# EAGLE schematic BEP33_12panel stencil (EAGLE 7.7.0), part 4 of 4
## Sheet 13 of 14
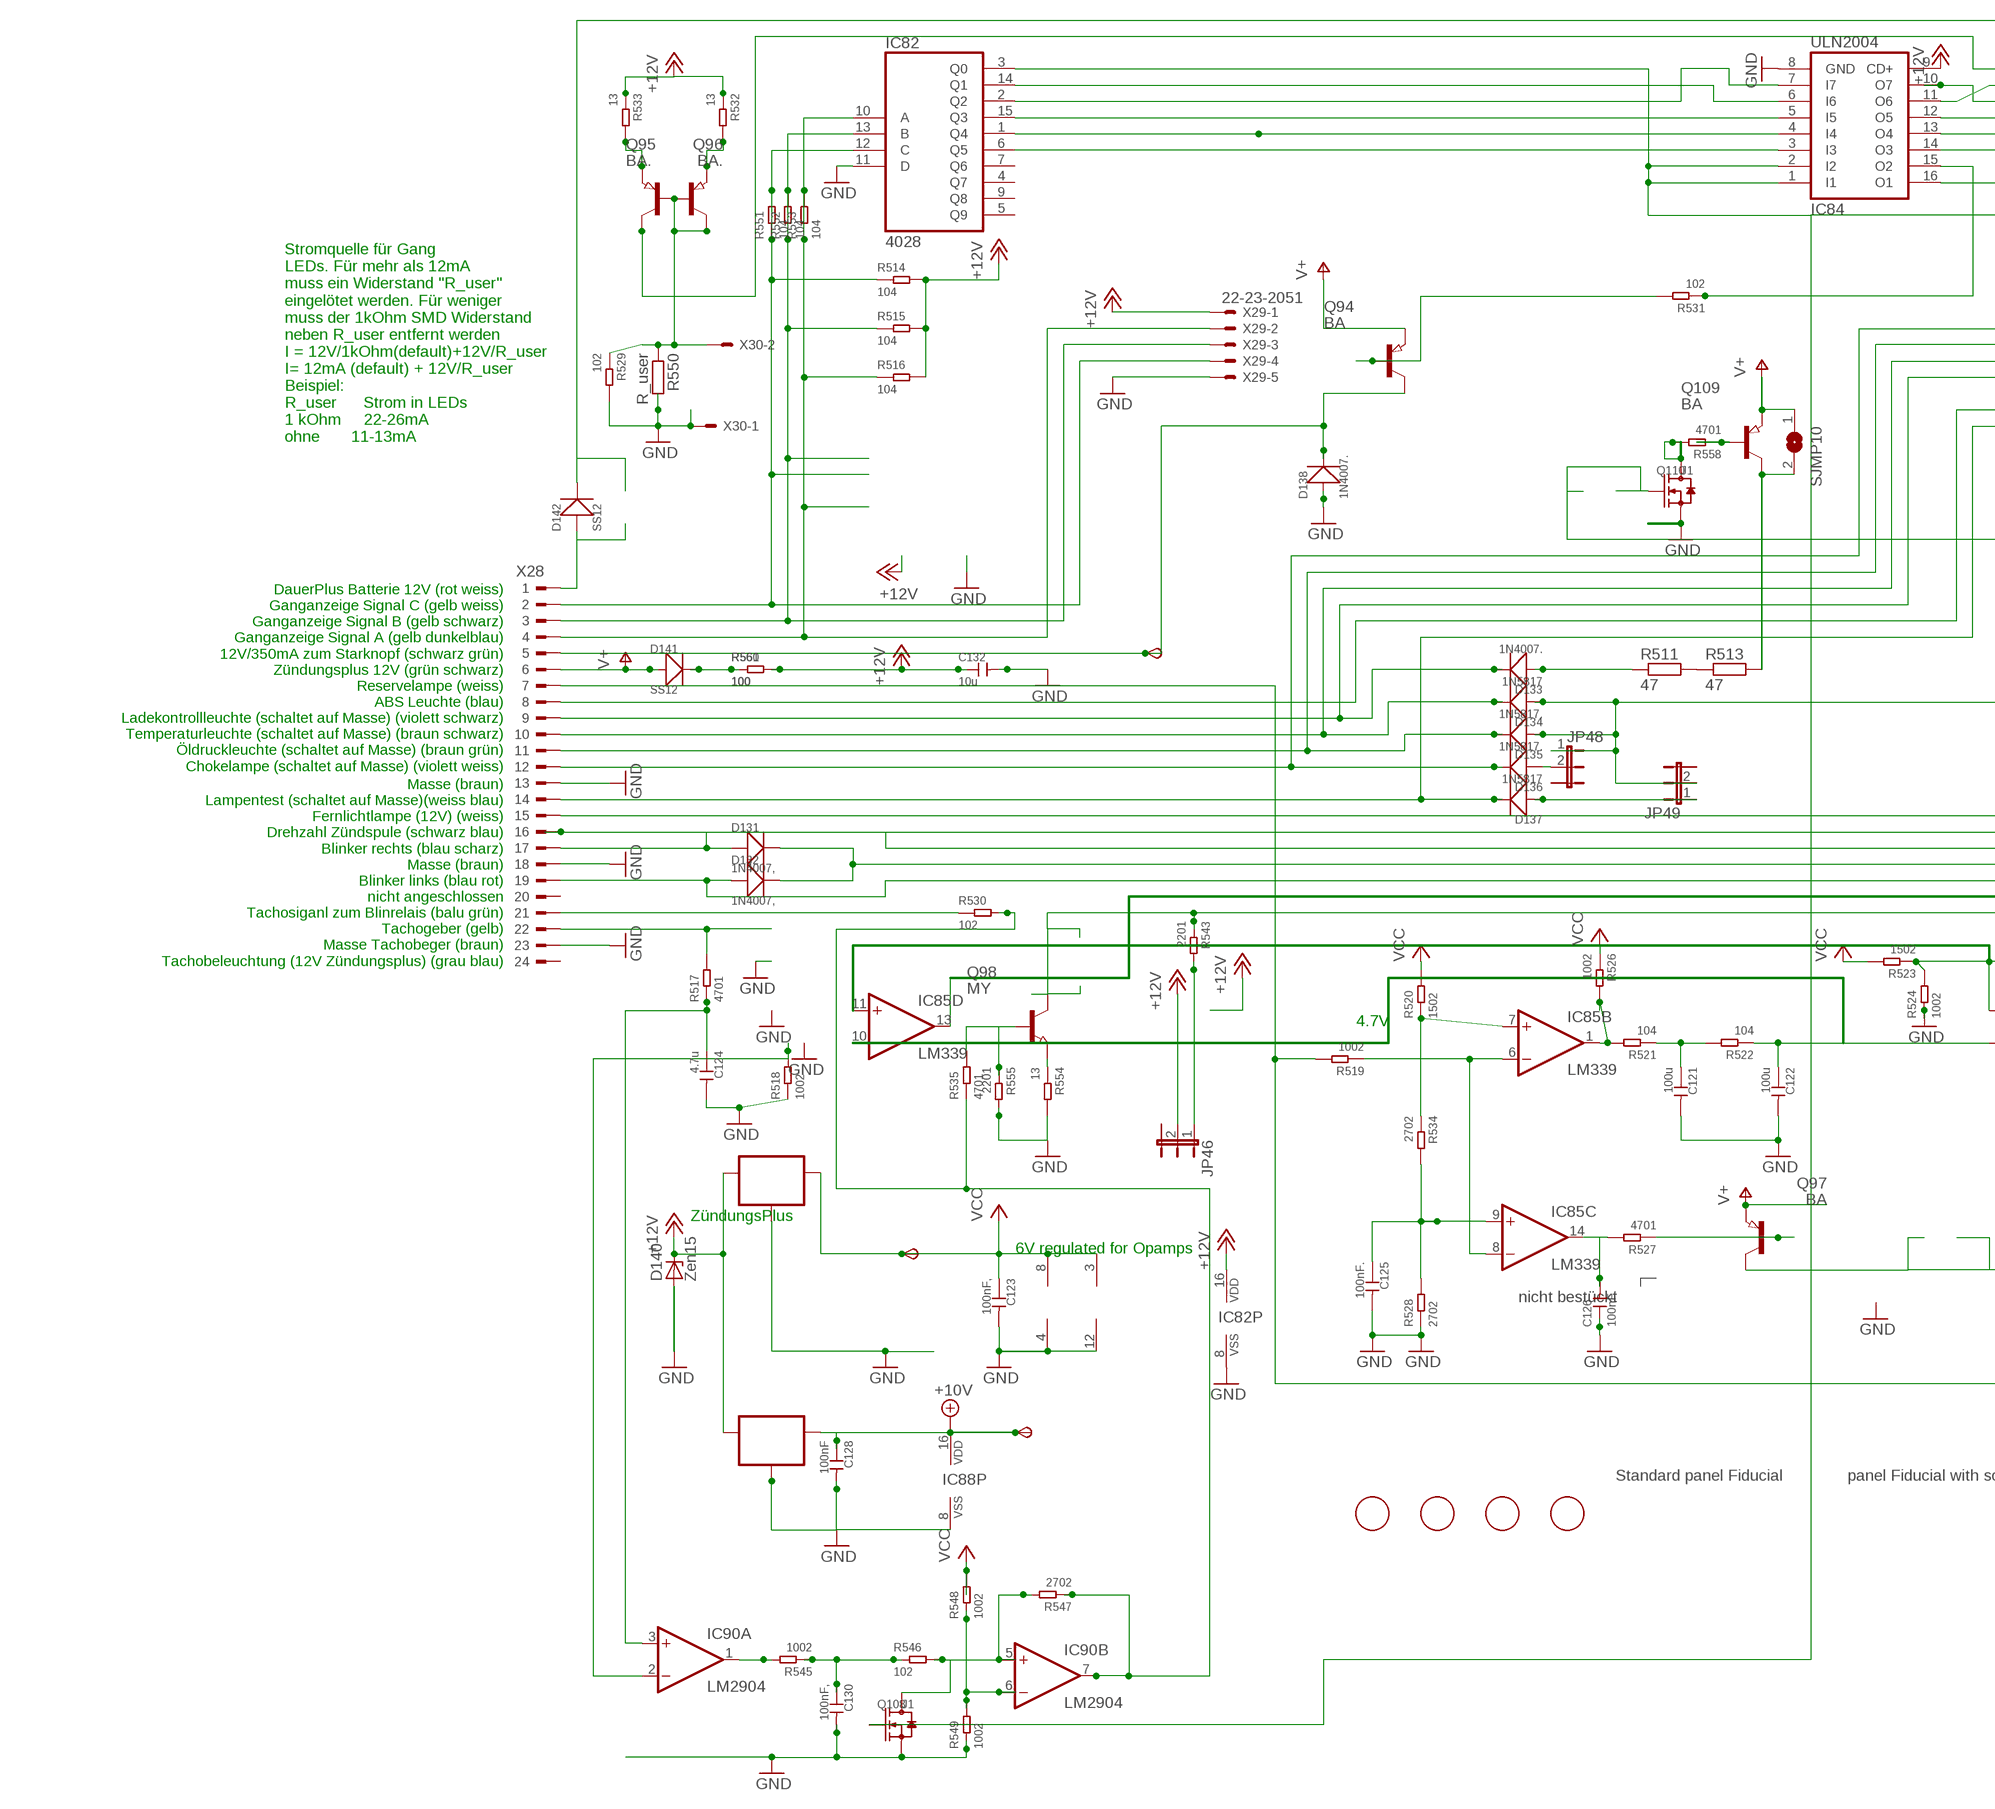
[diagram p22: schematic, sheet 13, part 1 of 2]
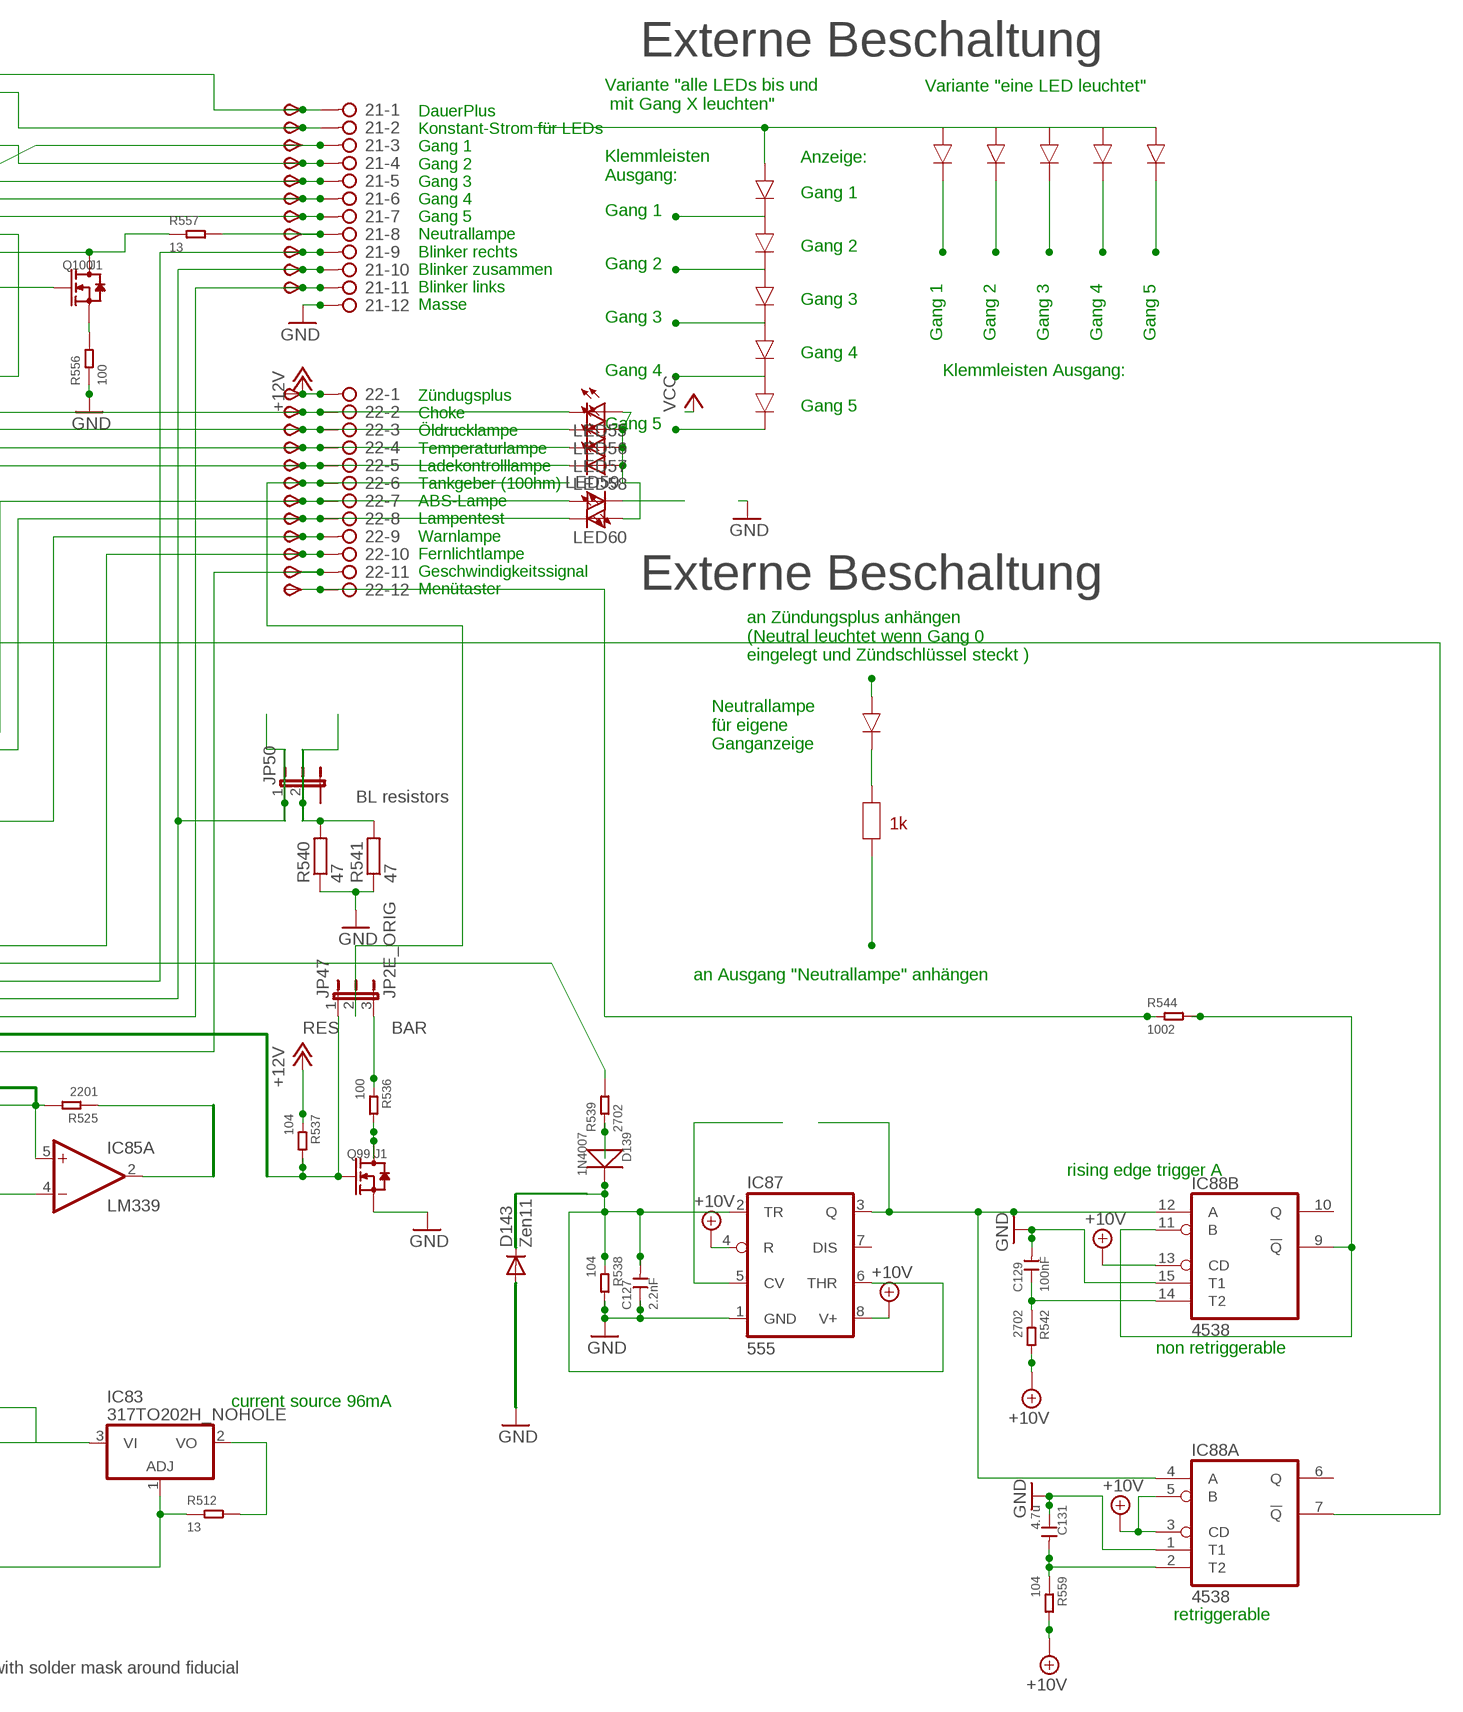
[diagram p23: schematic, sheet 13, part 2 of 2]

### Parts
6V10  TPSB2.0  [B2.0]
10V10  TPSB2.0  [B2.0]
21  2081-1132  [12-PIN]
22  2081-1132  [12-PIN]
C121  100u  CERAMIC-100UF-6.3V-20%-X5R(1206)  [C1206]
C122  100u  CERAMIC-100UF-6.3V-20%-X5R(1206)  [C1206]
C123  100nF,  CERAMIC-100NF-50V-10%-X7R(0805)  [C0805]
C124  4.7u  CERAMIC-4.7UF-25V-10%-X5R(0805)  [C0805]
C125  100nF.  CERAMIC-100NF-50V-10%-X7R(0805)  [C0805]
C126  100nF.  CERAMIC-100NF-50V-10%-X7R(0805)  [C0805]
C127  2.2nF  CERAMIC-100NF-50V-10%-X7R(0805)  [C0805]
C128  100nF  CERAMIC-100NF-50V-10%-X7R(0805)  [C0805]
C129  100nF  CERAMIC-100NF-50V-10%-X7R(0805)  [C0805]
C130  100nF,  CERAMIC-100NF-50V-10%-X7R(0805)  [C0805]
C131  4.7u  CERAMIC-4.7UF-25V-10%-X5R(0805)  [C0805]
C132  10u  CERAMIC-100UF-6.3V-20%-X5R(1206)  [C1206]
D131  1N4007,  DIODE-GEN-PURPOSE-1KV-1A(DO-214AC)  [DO-214AC]
D132  1N4007,  DIODE-GEN-PURPOSE-1KV-1A(DO-214AC)  [DO-214AC]
D133  1N4007.  DIODE-GEN-PURPOSE-1KV-1A(DO-214AC)  [DO-214AC]
D134  1N5817  DIODE-GEN-PURPOSE-1KV-1A(DO-214AC)DO-214AC/1206  [DO-214AC_SLIM]
D135  1N5817.  DIODE-GEN-PURPOSE-1KV-1A(DO-214AC)DO-214AC/1206  [DO-214AC_SLIM]
D136  1N5817.  DIODE-GEN-PURPOSE-1KV-1A(DO-214AC)DO-214AC/1206  [DO-214AC_SLIM]
D137  1N5817  DIODE-GEN-PURPOSE-1KV-1A(DO-214AC)DO-214AC/1206  [DO-214AC_SLIM]
D138  1N4007.  DIODE-GEN-PURPOSE-1KV-1A(DO-214AC)  [DO-214AC]
D139  1N4007  DIODE-GEN-PURPOSE-1KV-1A(DO-214AC)  [DO-214AC]
D140  Zen15  SM6T  [DO214AA]
D141  SS12  DIODE-GEN-PURPOSE-1KV-1A(DO-214AC)DO-214AC/1206  [DO-214AC_SLIM]
D142  SS12  DIODE-GEN-PURPOSE-1KV-1A(DO-214AC)DO-214AC/1206  [DO-214AC_SLIM]
D143  Zen11  CGRM4001-G  [SOD-123_MINI-SMA]
FID41  FIDUCIAL  [FIDUCIAL_1MM]
FID42  FIDUCIAL  [FIDUCIAL_1MM]
FID43  FIDUCIAL  [FIDUCIAL_1MM]
FID44  FIDUCIAL  [FIDUCIAL_1MM]
IC82  4028  4028D  [SO16]
IC83  317TO202H_NOHOLE  [TO220H_NOHOLE]
IC84  ULN2004  ULN2004AD  [SO16]
IC85  LM339  LM339D  [SO14]
IC86  78L06  78LXXSOT89_ROUND  [SOT89_ROUND]
IC87  555  NE555D  [SO08]
IC88  4538  4538D  [SO16]
IC89  78L10  78LXXSOT89_ROUND  [SOT89_ROUND]
IC90  LM2904  LM358D  [SO08]
JP46  JP2EJP2_SMALLPADS  [JP2_SMALLPADS]
JP47  JP2E_ORIG  [JP2_ORIG_SMALLPADS]
JP48  JP2EJP2_SMALLPADS  [JP2_SMALLPADS]
JP49  JP2EJP2_SMALLPADS  [JP2_SMALLPADS]
JP50  JP2EJP2_SMALLPADS  [JP2_SMALLPADS]
LED55  LEDLD260  [LD260]
LED56  LEDLD260  [LD260]
LED57  LEDLD260  [LD260]
LED58  LEDLD260  [LD260]
LED59  LEDLD260  [LD260]
LED60  LEDLD260  [LD260]
Q94  BA  PNP-TRANSISTOR_SOT89  [SOT89]
Q95  BA.  PNP-TRANSISTOR_SOT89  [SOT89]
Q96  BA.  PNP-TRANSISTOR_SOT89  [SOT89]
Q97  BA  PNP-TRANSISTOR_SOT89  [SOT89]
Q98  MY  NPN-TRANSISTOR_SOT89  [SOT89]
Q99  J1  SMD-MOSFET-N-CH-50V-200MA-BSS138W-7-F(SOT-23)  [SOT-23]
Q100  J1  SMD-MOSFET-N-CH-50V-200MA-BSS138W-7-F(SOT-23)  [SOT-23]
Q108  J1  SMD-MOSFET-N-CH-50V-200MA-BSS138W-7-F(SOT-23)  [SOT-23]
Q109  BA  PNP-TRANSISTOR_SOT89  [SOT89]
Q110  J1  SMD-MOSFET-N-CH-50V-200MA-BSS138W-7-F(SOT-23)  [SOT-23]
R511  47  R-EU_V235/17_1MM  [V235/17_1MM]
R512  13  SMD-RES-13R-5%-1/4W(1206)  [R1206]
R513  47  R-EU_V235/17_1MM  [V235/17_1MM]
R514  104  SMD-RES-10K-1%-1/8W(0805)  [R0805]
R515  104  SMD-RES-10K-1%-1/8W(0805)  [R0805]
R516  104  SMD-RES-10K-1%-1/8W(0805)  [R0805]
R517  4701  SMD-RES-4.7K-5%-1/8W(0805)  [R0805]
R518  1002  SMD-RES-10K-1%-1/8W(0805)  [R0805]
R519  1002  SMD-RES-10K-1%-1/8W(0805)  [R0805]
R520  1502  SMD-RES-10K-1%-1/8W(0805)  [R0805]
R521  104  SMD-RES-10K-1%-1/8W(0805)  [R0805]
R522  104  SMD-RES-10K-1%-1/8W(0805)  [R0805]
R523  1502  SMD-RES-10K-1%-1/8W(0805)  [R0805]
R524  1002  SMD-RES-10K-1%-1/8W(0805)  [R0805]
R525  2201  SMD-RES-2.2K-5%-1/8W(0805)  [R0805]
R526  1002  SMD-RES-10K-1%-1/8W(0805)  [R0805]
R527  4701  SMD-RES-4.7K-5%-1/8W(0805)  [R0805]
R528  2702  SMD-RES-4.7K-5%-1/8W(0805)  [R0805]
R529  102  SMD-RES-1K-5%-1/8W(0805)  [R0805]
R530  102  SMD-RES-220R-5%-1/8W(0805)  [R0805]
R531  102  SMD-RES-1K-5%-1/8W(0805)  [R0805]
R532  13  SMD-RES-13R-5%-1/4W(1206)  [R1206]
R533  13  SMD-RES-13R-5%-1/4W(1206)  [R1206]
R534  2702  SMD-RES-4.7K-5%-1/8W(0805)  [R0805]
R535  4701  SMD-RES-4.7K-5%-1/8W(0805)  [R0805]
R536  100  SMD-RES-2.2K-5%-1/8W(0805)  [R0805]
R537  104  SMD-RES-10K-1%-1/8W(0805)  [R0805]
R538  104  SMD-RES-10K-1%-1/8W(0805)  [R0805]
R539  2702  SMD-RES-10K-1%-1/8W(0805)  [R0805]
R540  47  R-EU_V235/17_1MM  [V235/17_1MM]
R541  47  R-EU_V235/17_1MM  [V235/17_1MM]
R542  2702  SMD-RES-4.7K-5%-1/8W(0805)  [R0805]
R543  2201  SMD-RES-2.2K-5%-1/8W(0805)  [R0805]
R544  1002  SMD-RES-4.7K-5%-1/8W(0805)  [R0805]
R545  1002  SMD-RES-10K-1%-1/8W(0805)  [R0805]
R546  102  SMD-RES-1K-5%-1/8W(0805)  [R0805]
R547  2702  SMD-RES-4.7K-5%-1/8W(0805)  [R0805]
R548  1002  SMD-RES-1K-5%-1/8W(0805)  [R0805]
R549  1002  SMD-RES-1K-5%-1/8W(0805)  [R0805]
R550  R_user  R-EU_R0805  [R0805]
R551  104  SMD-RES-10K-1%-1/8W(0805)  [R0805]
R552  104  SMD-RES-10K-1%-1/8W(0805)  [R0805]
R553  104  SMD-RES-10K-1%-1/8W(0805)  [R0805]
R554  13  SMD-RES-13R-5%-1/4W(1206)  [R1206]
R555  2201  SMD-RES-1K-5%-1/8W(0805)  [R0805]
R556  100  SMD-RES-220R-5%-1/8W(0805)  [R0805]
R557  13  SMD-RES-13R-5%-1/4W(1206)  [R1206]
R558  4701  SMD-RES-4.7K-5%-1/8W(0805)  [R0805]
R559  104  SMD-RES-4.7K-5%-1/8W(0805)  [R0805]
R560  100  SMD-RES-2.2K-5%-1/8W(0805)  [R0805]
R561  100  SMD-RES-2.2K-5%-1/8W(0805)  [R0805]
SJMP10  SJ  [SJ]
START10  TPSB2.0  [B2.0]
TP231  TPSB2.0  [B2.0]
TP232  TPSB2.0  [B2.0]
TP233  TPSB2.0  [B2.0]
TP234  TPSB2.0  [B2.0]
TP235  TPSB2.0  [B2.0]
TP236  TPSB2.0  [B2.0]
TP237  TPSB2.0  [B2.0]
TP238  TPSB2.0  [B2.0]
TP239  TPSB2.0  [B2.0]
TP240  TPSB2.0  [B2.0]
TP241  TPSB2.0  [B2.0]
TP242  TPSB2.0  [B2.0]
TP243  TPSB2.0  [B2.0]
TP244  TPSB2.0  [B2.0]
TP245  TPSB2.0  [B2.0]
TP246  TPSB2.0  [B2.0]
TP247  TPSB2.0  [B2.0]
TP248  TPSB2.0  [B2.0]
TP249  TPSB1,27  [B1,27]
TP250  TPSB2.0  [B2.0]
TP251  TPSB2.0  [B2.0]
TP252  TPSB2.0  [B2.0]
TP253  TPSB2.0  [B2.0]
X28  CON_BMWV2  [24-PIN_V2]
X29  22-23-2051  [22-23-2051]
X30  22-23-2021  [22-23-2021]

### Nets
+10V: 10V10.TP(PP) C128.1 IC87.4(R) IC87.8(V+) IC88.3(A:CD) IC88.5(A:B) IC88.13(B:CD) IC88.16(P:VDD) IC89.1(OUT) R542.2 R559.2 ; also sheet 2,3,4,5,6,7,9,10,11,12,14
+12V: 22.1 C132.1 D140.C IC82.16(VDD) IC84.9(CD+) IC86.3(IN) IC89.3(IN) JP46.2 R514.2 R515.2 R516.2 R532.1 R533.1 R537.1 R560.2 R561.2 TP252.TP(PP) X29.1 ; also sheet 2,3,4,5,6,7,9,10,11,12,14
+12V11: 22.11 Q98.2(C) R543.1 TP251.TP(PP)
GND: 21.12 C121.2 C122.2 C123.2 C124.2 C125.2 C126.1 C127.1 C128.2 C129.2 C130.2 C131.1 C132.2 D138.1(+) D140.A D143.A IC82.8(VSS) IC82.11(D) IC84.8(GND) IC85.12(P:GND) IC86.2(GND) IC86.2@1(GND) IC87.1(GND) IC88.1(A:T1) IC88.8(P:VSS) IC88.15(B:T1) IC89.2(GND) IC89.2@1(GND) IC90.4(P:V-) Q99.2(S) Q108.2(S) Q110.2(S) R518.1 R524.1 R528.1 R529.2 R538.2 R540.1 R541.1 R549.1 R550.2 R554.2 R555.2 R556.1 X28.13 X28.18 X28.23 X29.5 X30.1 ; also sheet 2,3,4,5,6,7,9,10,11,12,14
N$1800: R511.2 R513.1
N$1801: 22.9 D134.1(+) D135.1(+) JP48.1 JP49.2 TP249.TP(PP)
N$1802: IC82.10(A) R516.1 R553.1 R553.2 X28.4 X29.2
N$1803: IC82.13(B) R515.1 R552.1 R552.2 X28.3 X29.3
N$1804: D138.2(-) Q94.2(C) START10.TP(PP) X28.5
N$1805: IC82.12(C) R514.1 R551.1 R551.2 X28.2 X29.4
N$1806: 22.7 LED59.A TP247.TP(PP) X28.8
N$1807: 22.2 D136.2(-) LED55.K(C) TP242.TP(PP) X28.12
N$1808: 22.3 D135.2(-) LED56.K(C) TP243.TP(PP) X28.11
N$1809: 22.4 D134.2(-) LED57.K(C) TP244.TP(PP) X28.10
N$1810: 22.8 D137.2(-) LED60.K(C) TP248.TP(PP) X28.14
N$1811: 21.9 D131.1(+) TP239.TP(PP) X28.17
N$1812: 21.11 D132.1(+) TP241.TP(PP) X28.19
N$1813: R517.2 X28.22
N$1814: C124.1 IC90.3(A:+IN) R517.1
N$1815: IC85.1(B:OUT) R521.2 R526.2
N$1816: C121.1 R521.1 R522.2
N$1817: C122.1 IC85.4(A:-IN) IC85.10(D:-IN) R522.1
N$1818: IC85.5(A:+IN) IC85.11(D:+IN) R523.1 R524.2 R525.2
N$1819: C125.1 IC85.9(C:+IN) R528.2 R534.2
N$1820: C126.2 IC85.14(C:OUT) R527.2
N$1821: Q97.1(B) R527.1
N$1822: IC82.2(Q2) IC84.7(I7)
N$1823: 21.5 IC84.12(O5) TP235.TP(PP)
N$1824: IC82.1(Q4) IC84.4(I4)
N$1825: 22.10 TP250.TP(PP) X28.15
N$1826: 22.5 D133.2(-) LED58.K(C) TP245.TP(PP) X28.9
N$1827: D133.1(+) R511.1
N$1828: IC82.6(Q5) IC84.3(I3)
N$1829: 21.4 IC84.10(O7) TP234.TP(PP)
N$1830: IC83.1(ADJ) R512.1 R519.2 X28.7
N$1831: IC85.6(B:-IN) IC85.8(C:-IN) R519.1
N$1832: 21.2 Q96.2(C) TP232.TP(PP)
N$1833: 21.1 D142.2(-) TP231.TP(PP)
N$1847: R539.2 X28.16
N$1848: IC82.15(Q3) IC84.5(I5)
N$1849: 21.6 IC84.13(O4) TP236.TP(PP)
N$1850: 21.7 IC84.14(O3) TP237.TP(PP)
N$1851: 22.6 JP47.2 TP246.TP(PP)
N$1852: LED59.K(C)
N$1853: LED55.A LED56.A LED57.A LED58.A LED60.A
N$1854: Q94.1(B) R531.2
N$1855: IC82.3(Q0) IC84.1(I1) IC84.2(I2) Q100.1(G) Q108.1(G)
N$1856: IC82.14(Q1) IC84.6(I6)
N$1857: 21.3 IC84.11(O6) TP233.TP(PP)
N$1858: Q95.1(B) Q95.2(C) Q96.1(B) R529.1 R550.1 X30.2
N$1859: Q96.3(E) R533.2
N$1860: Q95.3(E) R532.2
N$1861: IC85.7(B:+IN) R520.1 R534.1
N$1862: IC90.2(A:-IN) R518.2
N$1863: Q98.1(B) R535.2 R555.1
N$1864: Q99.3(D) R536.2
N$1865: IC83.2(VO) R512.2
N$1866: IC83.3(VI) Q97.2(C)
N$1867: IC87.5(CV)
N$1868: IC87.3(Q) IC88.4(A:A) IC88.12(B:A)
N$1869: D139.1(+) R539.1
N$1870: 21.10 D131.2(-) D132.2(-) JP50.1 TP240.TP(PP)
N$1871: JP50.2 R540.2 R541.2
N$1872: IC88.9(B:!Q) IC88.11(B:B) R544.2
N$1873: C129.1 IC88.14(B:T2) R542.1
N$1874: JP46.1 R543.2
N$1875: IC84.15(O2) R531.1
N$1876: 22.12 R544.1 TP253.TP(PP)
N$1877: D136.1(+) JP48.2
N$1878: IC90.1(A:OUT) R545.2
N$1879: C130.1 R545.1 R546.1
N$1880: IC90.5(B:+IN) Q108.3(D) R546.2 R547.2
N$1881: IC90.6(B:-IN) R548.1 R549.2
N$1882: D137.1(+) JP49.1
N$1883: JP47.3 R536.1
N$1884: IC85.13(D:OUT) JP47.1 Q99.1(G) R537.2
N$1885: R530.1 X28.21
N$1886: IC84.16(O1) Q100.3(D) R557.1
N$1887: D141.2(-) R560.1 R561.1
N$1888: 21.8 R557.2 TP238.TP(PP)
N$1889: Q100.2(S) R556.2
N$1890: D142.1(+) X28.1
N$1891: Q98.3(E) R554.1
N$1892: C127.2 D139.2(-) D143.C IC87.2(TR) IC87.6(THR) R538.1
N$1893: Q109.1(B) R558.1
N$1894: Q110.3(D) R558.2
N$1895: Q109.2(C) R513.2 SJMP10.2
N$1896: IC90.7(B:OUT) R530.2 R535.1 R547.1
N$1897: IC85.2(A:OUT) R525.1
N$1898: IC88.7(A:!Q) Q110.1(G)
N$1899: C131.2 IC88.2(A:T2) R559.1
V+: D141.1(+) Q94.3(E) Q97.3(E) Q109.3(E) SJMP10.1 X28.6 ; also sheet 2,3,4,5,6,7,9,10,11,12,14
VCC: 6V10.TP(PP) C123.1 IC85.3(P:V+) IC86.1(OUT) IC90.8(P:V+) R520.2 R523.2 R526.1 R548.2 ; also sheet 2,3,4,5,6,7,9,10,11,12,14
Unconnected: IC82.4(Q7) IC82.5(Q9) IC82.7(Q6) IC82.9(Q8) IC87.7(DIS) IC88.6(A:Q) IC88.10(B:Q) X28.20 X28.24

### Notes on the sheet
- Externe Beschaltung
- Variante "eine LED leuchtet"
- Variante "alle LEDs bis und
   mit Gang X leuchten"
- Anzeige:
- Klemmleisten
  Ausgang:
- Gang 1
- DauerPlus
  Konstant-Strom für LEDs
  Gang 1
  Gang 2
  Gang 3
  Gang 4
  Gang 5
  Neutrallampe
  Blinker rechts
  Blinker zusammen
  Blinker links
  Masse
- Gang 1
- Gang 2
- Gang 2
- Gang 3
- Gang 3
- Gang 1 | Gang 2 | Gang 3 | Gang 4 | Gang 5
- Gang 4
- Gang 4 | Klemmleisten Ausgang:
- Gang 5
- Gang 5
- Zündugsplus
  Choke
  Öldrucklampe
  Temperaturlampe
  Ladekontrolllampe
  Tankgeber (100hm)
  ABS-Lampe
  Lampentest
  Warnlampe
  Fernlichtlampe
  Geschwindigkeitssignal
  Menütaster
- Stromquelle für Gang
  LEDs. Für mehr als 12mA
  muss ein Widerstand "R_user"
  eingelötet werden. Für weniger
  muss der 1kOhm SMD Widerstand
  neben R_user entfernt werden
  I = 12V/1kOhm(default)+12V/R_user
  I= 12mA (default) + 12V/R_user
  Beispiel:
  R_user      Strom in LEDs
  1 kOhm     22-26mA
  ohne       11-13mA
- Externe Beschaltung
- an Zündungsplus anhängen
  (Neutral leuchtet wenn Gang 0
  eingelegt und Zündschlüssel steckt )
- Neutrallampe
  für eigene
  Ganganzeige
- DauerPlus Batterie 12V (rot weiss)
  Ganganzeige Signal C (gelb weiss)
  Ganganzeige Signal B (gelb schwarz)
  Ganganzeige Signal A (gelb dunkelblau)
  12V/350mA zum Starknopf (schwarz grün)
  Zündungsplus 12V (grün schwarz)
  Reservelampe (weiss)
  ABS Leuchte (blau)
  Ladekontrollleuchte (schaltet auf Masse) (violett schwarz)
  Temperaturleuchte (schaltet auf Masse) (braun schwarz)
  Öldruckleuchte (schaltet auf Masse) (braun grün)
  Chokelampe (schaltet auf Masse) (violett weiss)
- BL resistors
- 1k
- an Ausgang "Neutrallampe" anhängen
- Masse (braun)
  Lampentest (schaltet auf Masse)(weiss blau)
  Fernlichtlampe (12V) (weiss)
  Drehzahl Zündspule (schwarz blau)
  Blinker rechts (blau scharz)
  Masse (braun)
  Blinker links (blau rot)
  nicht angeschlossen
  Tachosiganl zum Blinrelais (balu grün)
  Tachogeber (gelb)
  Masse Tachobeger (braun)
  Tachobeleuchtung (12V Zündungsplus) (grau blau)
- RES | BAR
- 4.7V | rising edge trigger A
- non retriggerable
- ZündungsPlus
- current source 96mA
- 6V regulated for Opamps
- nicht bestückt
- retriggerable
- Standard panel Fiducial | panel Fiducial with solder mask around fiducial

## Sheet 14 of 14
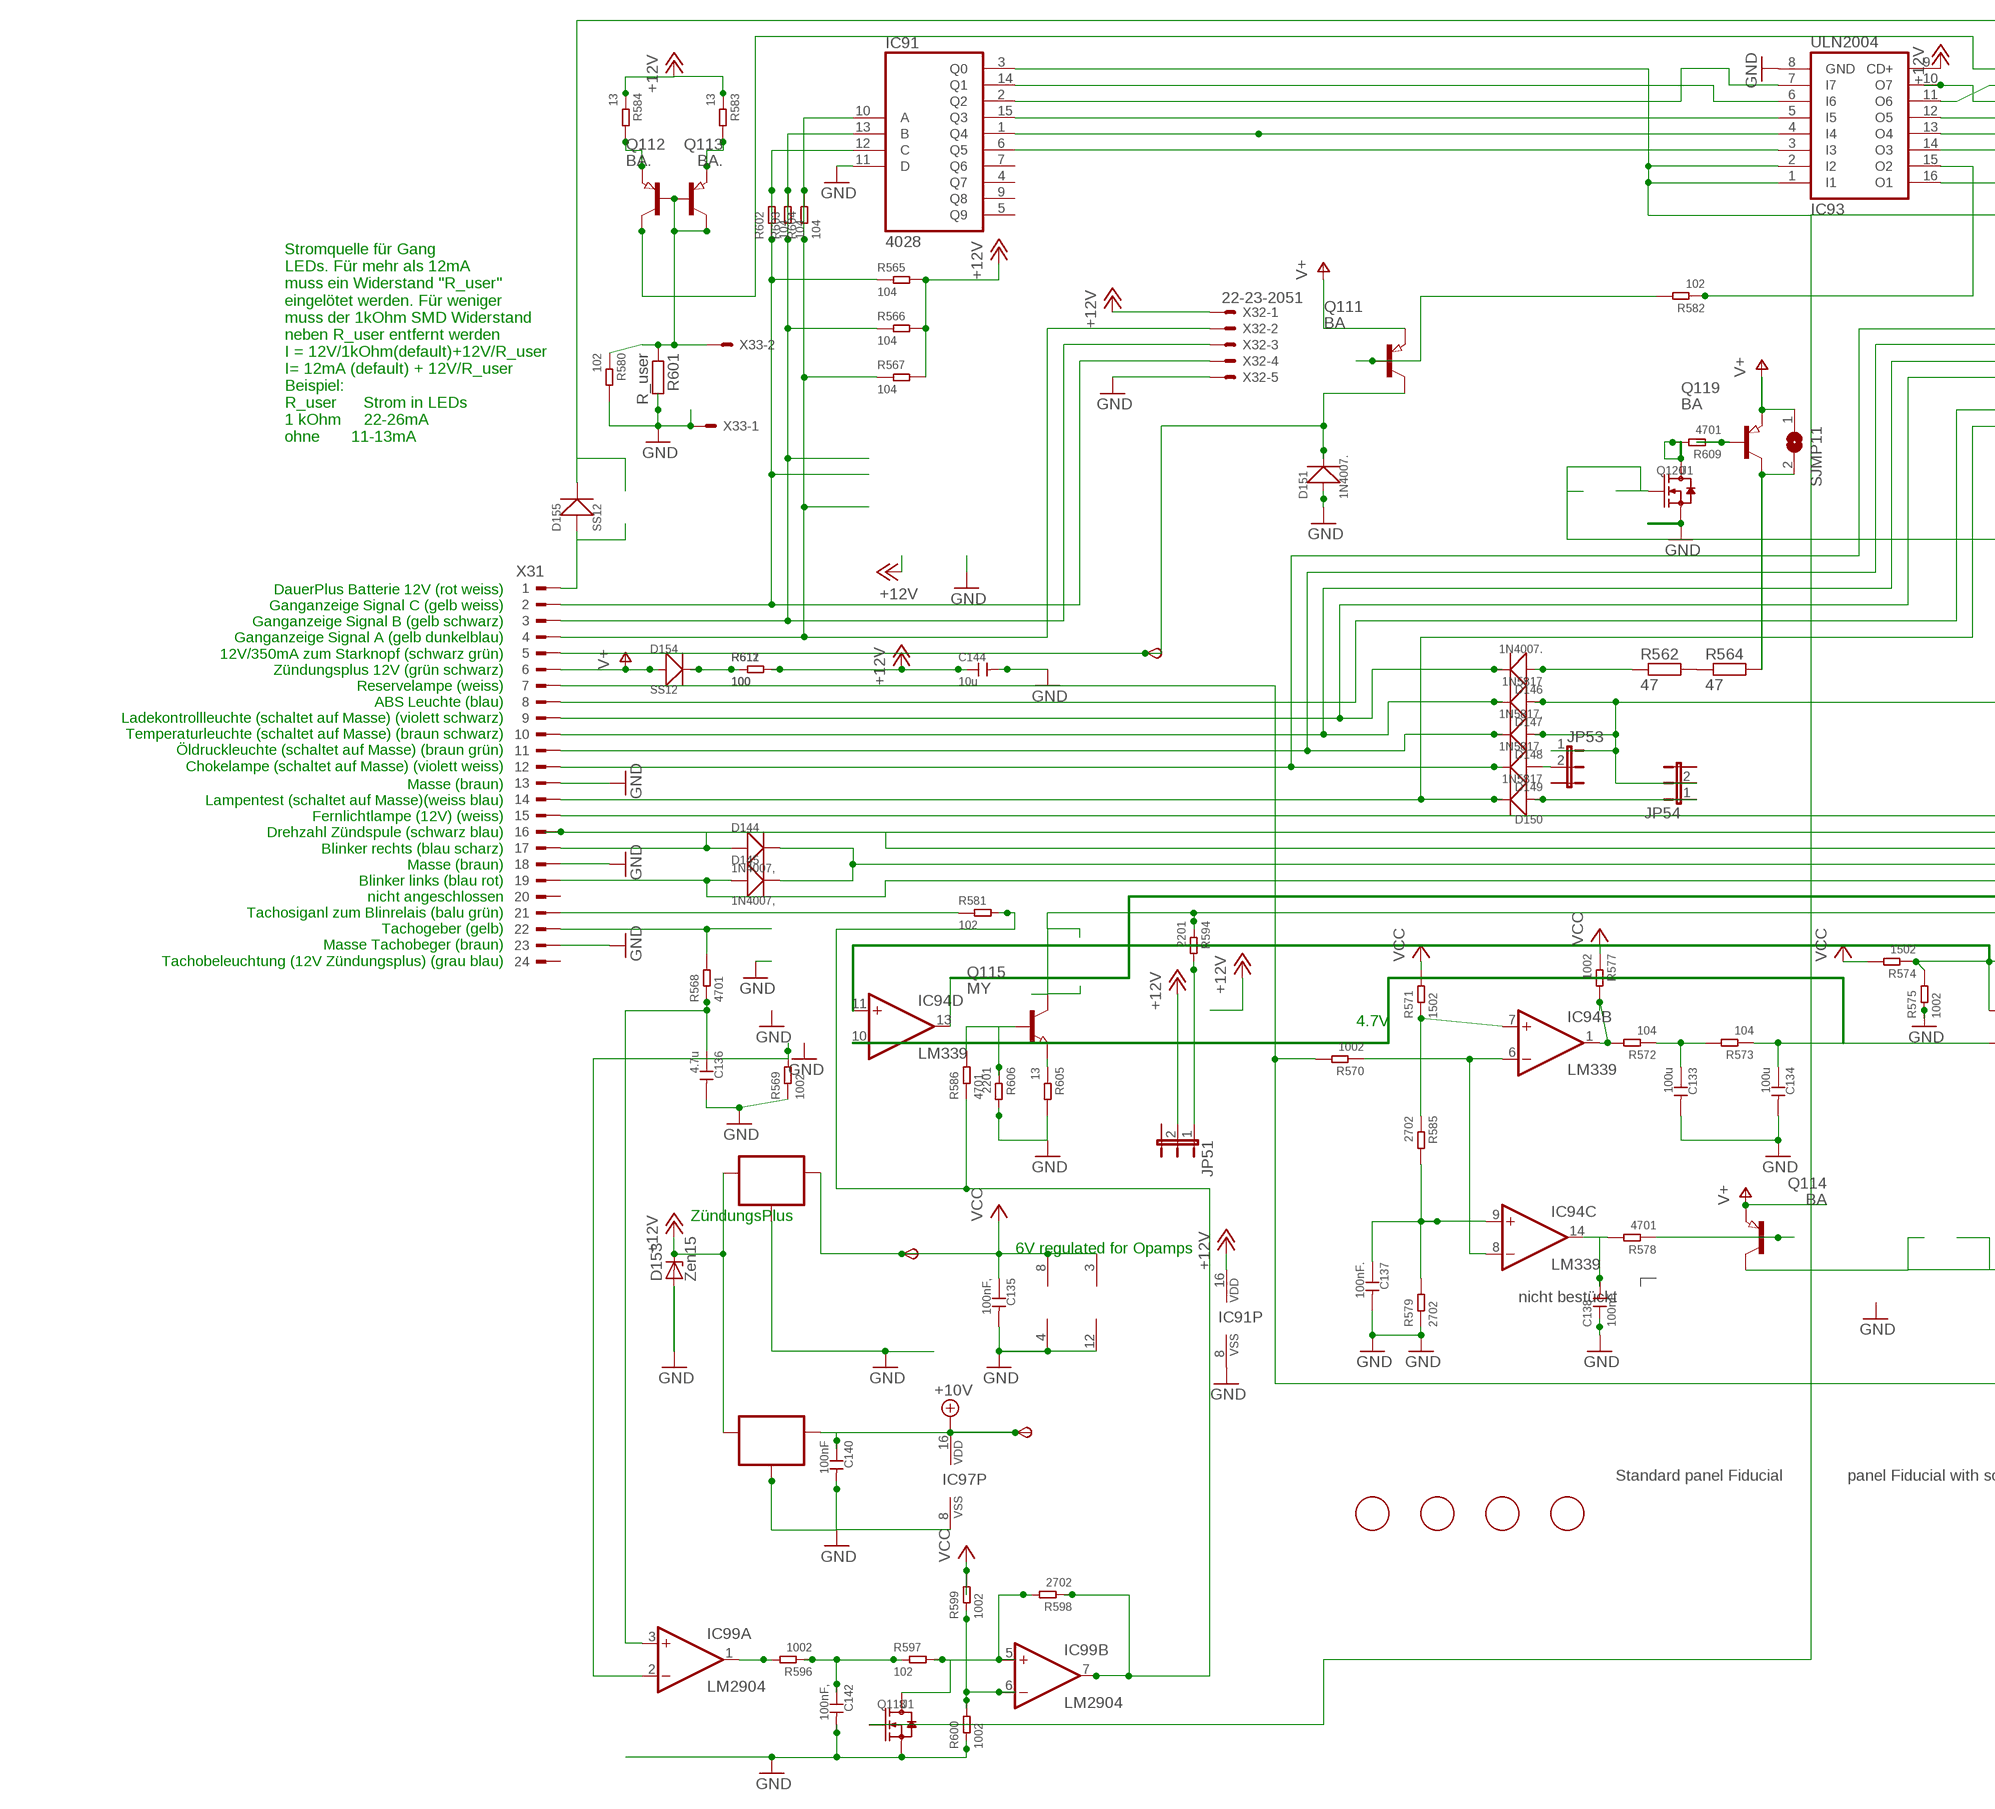
[diagram p24: schematic, sheet 14, part 1 of 2]
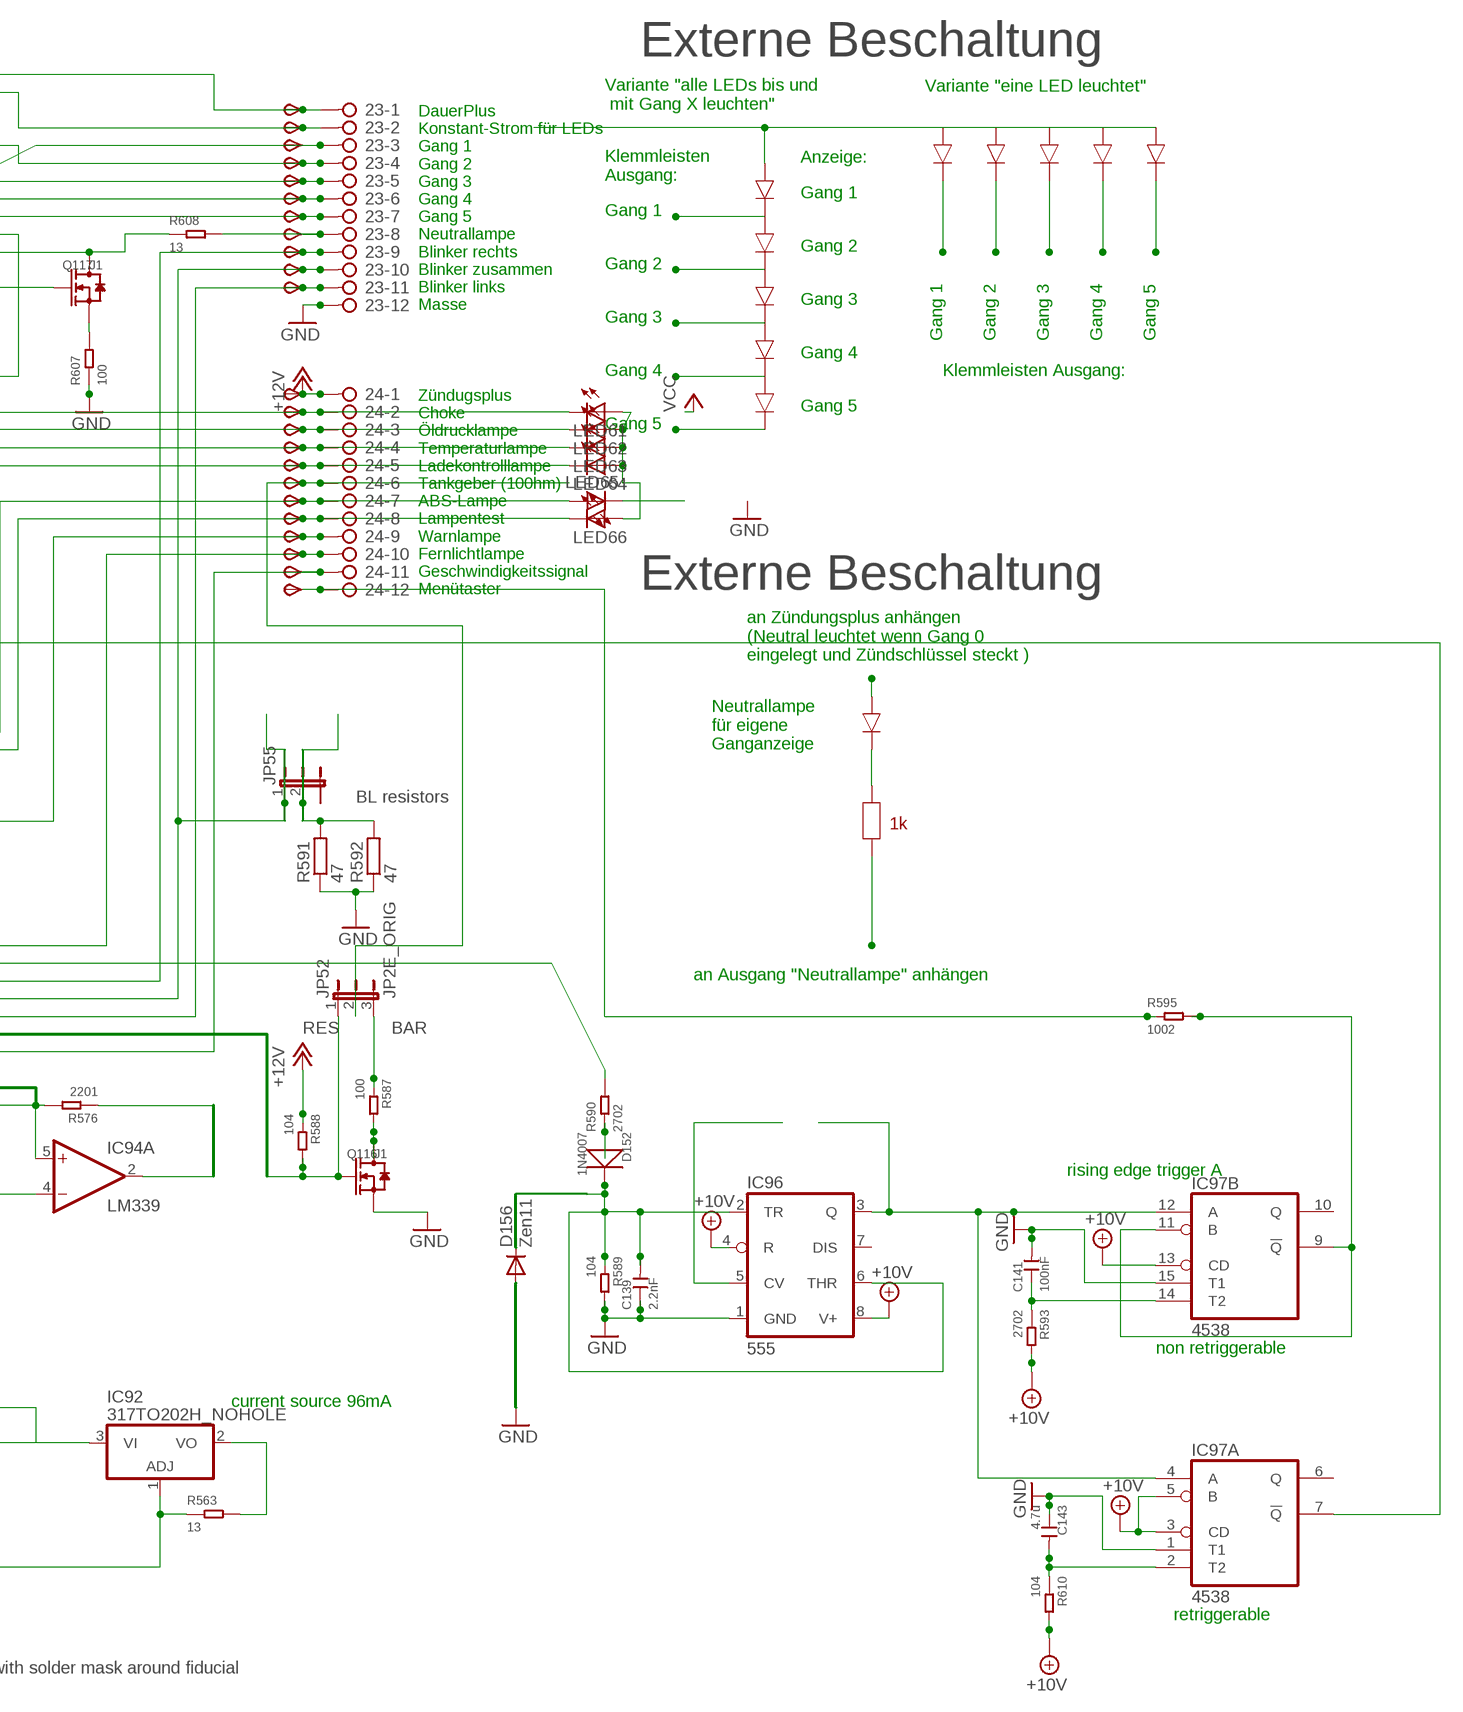
[diagram p25: schematic, sheet 14, part 2 of 2]

### Parts
6V11  TPSB2.0  [B2.0]
10V11  TPSB2.0  [B2.0]
23  2081-1132  [12-PIN]
24  2081-1132  [12-PIN]
C133  100u  CERAMIC-100UF-6.3V-20%-X5R(1206)  [C1206]
C134  100u  CERAMIC-100UF-6.3V-20%-X5R(1206)  [C1206]
C135  100nF,  CERAMIC-100NF-50V-10%-X7R(0805)  [C0805]
C136  4.7u  CERAMIC-4.7UF-25V-10%-X5R(0805)  [C0805]
C137  100nF.  CERAMIC-100NF-50V-10%-X7R(0805)  [C0805]
C138  100nF.  CERAMIC-100NF-50V-10%-X7R(0805)  [C0805]
C139  2.2nF  CERAMIC-100NF-50V-10%-X7R(0805)  [C0805]
C140  100nF  CERAMIC-100NF-50V-10%-X7R(0805)  [C0805]
C141  100nF  CERAMIC-100NF-50V-10%-X7R(0805)  [C0805]
C142  100nF,  CERAMIC-100NF-50V-10%-X7R(0805)  [C0805]
C143  4.7u  CERAMIC-4.7UF-25V-10%-X5R(0805)  [C0805]
C144  10u  CERAMIC-100UF-6.3V-20%-X5R(1206)  [C1206]
D144  1N4007,  DIODE-GEN-PURPOSE-1KV-1A(DO-214AC)  [DO-214AC]
D145  1N4007,  DIODE-GEN-PURPOSE-1KV-1A(DO-214AC)  [DO-214AC]
D146  1N4007.  DIODE-GEN-PURPOSE-1KV-1A(DO-214AC)  [DO-214AC]
D147  1N5817  DIODE-GEN-PURPOSE-1KV-1A(DO-214AC)DO-214AC/1206  [DO-214AC_SLIM]
D148  1N5817.  DIODE-GEN-PURPOSE-1KV-1A(DO-214AC)DO-214AC/1206  [DO-214AC_SLIM]
D149  1N5817.  DIODE-GEN-PURPOSE-1KV-1A(DO-214AC)DO-214AC/1206  [DO-214AC_SLIM]
D150  1N5817  DIODE-GEN-PURPOSE-1KV-1A(DO-214AC)DO-214AC/1206  [DO-214AC_SLIM]
D151  1N4007.  DIODE-GEN-PURPOSE-1KV-1A(DO-214AC)  [DO-214AC]
D152  1N4007  DIODE-GEN-PURPOSE-1KV-1A(DO-214AC)  [DO-214AC]
D153  Zen15  SM6T  [DO214AA]
D154  SS12  DIODE-GEN-PURPOSE-1KV-1A(DO-214AC)DO-214AC/1206  [DO-214AC_SLIM]
D155  SS12  DIODE-GEN-PURPOSE-1KV-1A(DO-214AC)DO-214AC/1206  [DO-214AC_SLIM]
D156  Zen11  CGRM4001-G  [SOD-123_MINI-SMA]
FID45  FIDUCIAL  [FIDUCIAL_1MM]
FID46  FIDUCIAL  [FIDUCIAL_1MM]
FID47  FIDUCIAL  [FIDUCIAL_1MM]
FID48  FIDUCIAL  [FIDUCIAL_1MM]
IC91  4028  4028D  [SO16]
IC92  317TO202H_NOHOLE  [TO220H_NOHOLE]
IC93  ULN2004  ULN2004AD  [SO16]
IC94  LM339  LM339D  [SO14]
IC95  78L06  78LXXSOT89_ROUND  [SOT89_ROUND]
IC96  555  NE555D  [SO08]
IC97  4538  4538D  [SO16]
IC98  78L10  78LXXSOT89_ROUND  [SOT89_ROUND]
IC99  LM2904  LM358D  [SO08]
JP51  JP2EJP2_SMALLPADS  [JP2_SMALLPADS]
JP52  JP2E_ORIG  [JP2_ORIG_SMALLPADS]
JP53  JP2EJP2_SMALLPADS  [JP2_SMALLPADS]
JP54  JP2EJP2_SMALLPADS  [JP2_SMALLPADS]
JP55  JP2EJP2_SMALLPADS  [JP2_SMALLPADS]
LED61  LEDLD260  [LD260]
LED62  LEDLD260  [LD260]
LED63  LEDLD260  [LD260]
LED64  LEDLD260  [LD260]
LED65  LEDLD260  [LD260]
LED66  LEDLD260  [LD260]
Q111  BA  PNP-TRANSISTOR_SOT89  [SOT89]
Q112  BA.  PNP-TRANSISTOR_SOT89  [SOT89]
Q113  BA.  PNP-TRANSISTOR_SOT89  [SOT89]
Q114  BA  PNP-TRANSISTOR_SOT89  [SOT89]
Q115  MY  NPN-TRANSISTOR_SOT89  [SOT89]
Q116  J1  SMD-MOSFET-N-CH-50V-200MA-BSS138W-7-F(SOT-23)  [SOT-23]
Q117  J1  SMD-MOSFET-N-CH-50V-200MA-BSS138W-7-F(SOT-23)  [SOT-23]
Q118  J1  SMD-MOSFET-N-CH-50V-200MA-BSS138W-7-F(SOT-23)  [SOT-23]
Q119  BA  PNP-TRANSISTOR_SOT89  [SOT89]
Q120  J1  SMD-MOSFET-N-CH-50V-200MA-BSS138W-7-F(SOT-23)  [SOT-23]
R562  47  R-EU_V235/17_1MM  [V235/17_1MM]
R563  13  SMD-RES-13R-5%-1/4W(1206)  [R1206]
R564  47  R-EU_V235/17_1MM  [V235/17_1MM]
R565  104  SMD-RES-10K-1%-1/8W(0805)  [R0805]
R566  104  SMD-RES-10K-1%-1/8W(0805)  [R0805]
R567  104  SMD-RES-10K-1%-1/8W(0805)  [R0805]
R568  4701  SMD-RES-4.7K-5%-1/8W(0805)  [R0805]
R569  1002  SMD-RES-10K-1%-1/8W(0805)  [R0805]
R570  1002  SMD-RES-10K-1%-1/8W(0805)  [R0805]
R571  1502  SMD-RES-10K-1%-1/8W(0805)  [R0805]
R572  104  SMD-RES-10K-1%-1/8W(0805)  [R0805]
R573  104  SMD-RES-10K-1%-1/8W(0805)  [R0805]
R574  1502  SMD-RES-10K-1%-1/8W(0805)  [R0805]
R575  1002  SMD-RES-10K-1%-1/8W(0805)  [R0805]
R576  2201  SMD-RES-2.2K-5%-1/8W(0805)  [R0805]
R577  1002  SMD-RES-10K-1%-1/8W(0805)  [R0805]
R578  4701  SMD-RES-4.7K-5%-1/8W(0805)  [R0805]
R579  2702  SMD-RES-4.7K-5%-1/8W(0805)  [R0805]
R580  102  SMD-RES-1K-5%-1/8W(0805)  [R0805]
R581  102  SMD-RES-220R-5%-1/8W(0805)  [R0805]
R582  102  SMD-RES-1K-5%-1/8W(0805)  [R0805]
R583  13  SMD-RES-13R-5%-1/4W(1206)  [R1206]
R584  13  SMD-RES-13R-5%-1/4W(1206)  [R1206]
R585  2702  SMD-RES-4.7K-5%-1/8W(0805)  [R0805]
R586  4701  SMD-RES-4.7K-5%-1/8W(0805)  [R0805]
R587  100  SMD-RES-2.2K-5%-1/8W(0805)  [R0805]
R588  104  SMD-RES-10K-1%-1/8W(0805)  [R0805]
R589  104  SMD-RES-10K-1%-1/8W(0805)  [R0805]
R590  2702  SMD-RES-10K-1%-1/8W(0805)  [R0805]
R591  47  R-EU_V235/17_1MM  [V235/17_1MM]
R592  47  R-EU_V235/17_1MM  [V235/17_1MM]
R593  2702  SMD-RES-4.7K-5%-1/8W(0805)  [R0805]
R594  2201  SMD-RES-2.2K-5%-1/8W(0805)  [R0805]
R595  1002  SMD-RES-4.7K-5%-1/8W(0805)  [R0805]
R596  1002  SMD-RES-10K-1%-1/8W(0805)  [R0805]
R597  102  SMD-RES-1K-5%-1/8W(0805)  [R0805]
R598  2702  SMD-RES-4.7K-5%-1/8W(0805)  [R0805]
R599  1002  SMD-RES-1K-5%-1/8W(0805)  [R0805]
R600  1002  SMD-RES-1K-5%-1/8W(0805)  [R0805]
R601  R_user  R-EU_R0805  [R0805]
R602  104  SMD-RES-10K-1%-1/8W(0805)  [R0805]
R603  104  SMD-RES-10K-1%-1/8W(0805)  [R0805]
R604  104  SMD-RES-10K-1%-1/8W(0805)  [R0805]
R605  13  SMD-RES-13R-5%-1/4W(1206)  [R1206]
R606  2201  SMD-RES-1K-5%-1/8W(0805)  [R0805]
R607  100  SMD-RES-220R-5%-1/8W(0805)  [R0805]
R608  13  SMD-RES-13R-5%-1/4W(1206)  [R1206]
R609  4701  SMD-RES-4.7K-5%-1/8W(0805)  [R0805]
R610  104  SMD-RES-4.7K-5%-1/8W(0805)  [R0805]
R611  100  SMD-RES-2.2K-5%-1/8W(0805)  [R0805]
R612  100  SMD-RES-2.2K-5%-1/8W(0805)  [R0805]
SJMP11  SJ  [SJ]
START11  TPSB2.0  [B2.0]
TP254  TPSB2.0  [B2.0]
TP255  TPSB2.0  [B2.0]
TP256  TPSB2.0  [B2.0]
TP257  TPSB2.0  [B2.0]
TP258  TPSB2.0  [B2.0]
TP259  TPSB2.0  [B2.0]
TP260  TPSB2.0  [B2.0]
TP261  TPSB2.0  [B2.0]
TP262  TPSB2.0  [B2.0]
TP263  TPSB2.0  [B2.0]
TP264  TPSB2.0  [B2.0]
TP265  TPSB2.0  [B2.0]
TP266  TPSB2.0  [B2.0]
TP267  TPSB2.0  [B2.0]
TP268  TPSB2.0  [B2.0]
TP269  TPSB2.0  [B2.0]
TP270  TPSB2.0  [B2.0]
TP271  TPSB2.0  [B2.0]
TP272  TPSB1,27  [B1,27]
TP273  TPSB2.0  [B2.0]
TP274  TPSB2.0  [B2.0]
TP275  TPSB2.0  [B2.0]
TP276  TPSB2.0  [B2.0]
X31  CON_BMWV2  [24-PIN_V2]
X32  22-23-2051  [22-23-2051]
X33  22-23-2021  [22-23-2021]

### Nets
+10V: 10V11.TP(PP) C140.1 IC96.4(R) IC96.8(V+) IC97.3(A:CD) IC97.5(A:B) IC97.13(B:CD) IC97.16(P:VDD) IC98.1(OUT) R593.2 R610.2 ; also sheet 2,3,4,5,6,7,9,10,11,12,13
+12V: 24.1 C144.1 D153.C IC91.16(VDD) IC93.9(CD+) IC95.3(IN) IC98.3(IN) JP51.2 R565.2 R566.2 R567.2 R583.1 R584.1 R588.1 R611.2 R612.2 TP275.TP(PP) X32.1 ; also sheet 2,3,4,5,6,7,9,10,11,12,13
+12V12: 24.11 Q115.2(C) R594.1 TP274.TP(PP)
GND: 23.12 C133.2 C134.2 C135.2 C136.2 C137.2 C138.1 C139.1 C140.2 C141.2 C142.2 C143.1 C144.2 D151.1(+) D153.A D156.A IC91.8(VSS) IC91.11(D) IC93.8(GND) IC94.12(P:GND) IC95.2(GND) IC95.2@1(GND) IC96.1(GND) IC97.1(A:T1) IC97.8(P:VSS) IC97.15(B:T1) IC98.2(GND) IC98.2@1(GND) IC99.4(P:V-) Q116.2(S) Q118.2(S) Q120.2(S) R569.1 R575.1 R579.1 R580.2 R589.2 R591.1 R592.1 R600.1 R601.2 R605.2 R606.2 R607.1 X31.13 X31.18 X31.23 X32.5 X33.1 ; also sheet 2,3,4,5,6,7,9,10,11,12,13
N$1900: R562.2 R564.1
N$1901: 24.9 D147.1(+) D148.1(+) JP53.1 JP54.2 TP272.TP(PP)
N$1902: IC91.10(A) R567.1 R604.1 R604.2 X31.4 X32.2
N$1903: IC91.13(B) R566.1 R603.1 R603.2 X31.3 X32.3
N$1904: D151.2(-) Q111.2(C) START11.TP(PP) X31.5
N$1905: IC91.12(C) R565.1 R602.1 R602.2 X31.2 X32.4
N$1906: 24.7 LED65.A TP270.TP(PP) X31.8
N$1907: 24.2 D149.2(-) LED61.K(C) TP265.TP(PP) X31.12
N$1908: 24.3 D148.2(-) LED62.K(C) TP266.TP(PP) X31.11
N$1909: 24.4 D147.2(-) LED63.K(C) TP267.TP(PP) X31.10
N$1910: 24.8 D150.2(-) LED66.K(C) TP271.TP(PP) X31.14
N$1911: 23.9 D144.1(+) TP262.TP(PP) X31.17
N$1912: 23.11 D145.1(+) TP264.TP(PP) X31.19
N$1913: R568.2 X31.22
N$1914: C136.1 IC99.3(A:+IN) R568.1
N$1915: IC94.1(B:OUT) R572.2 R577.2
N$1916: C133.1 R572.1 R573.2
N$1917: C134.1 IC94.4(A:-IN) IC94.10(D:-IN) R573.1
N$1918: IC94.5(A:+IN) IC94.11(D:+IN) R574.1 R575.2 R576.2
N$1919: C137.1 IC94.9(C:+IN) R579.2 R585.2
N$1920: C138.2 IC94.14(C:OUT) R578.2
N$1921: Q114.1(B) R578.1
N$1922: IC91.2(Q2) IC93.7(I7)
N$1923: 23.5 IC93.12(O5) TP258.TP(PP)
N$1924: IC91.1(Q4) IC93.4(I4)
N$1925: 24.10 TP273.TP(PP) X31.15
N$1926: 24.5 D146.2(-) LED64.K(C) TP268.TP(PP) X31.9
N$1927: D146.1(+) R562.1
N$1928: IC91.6(Q5) IC93.3(I3)
N$1929: 23.4 IC93.10(O7) TP257.TP(PP)
N$1930: IC92.1(ADJ) R563.1 R570.2 X31.7
N$1931: IC94.6(B:-IN) IC94.8(C:-IN) R570.1
N$1932: 23.2 Q113.2(C) TP255.TP(PP)
N$1933: 23.1 D155.2(-) TP254.TP(PP)
N$1947: R590.2 X31.16
N$1948: IC91.15(Q3) IC93.5(I5)
N$1949: 23.6 IC93.13(O4) TP259.TP(PP)
N$1950: 23.7 IC93.14(O3) TP260.TP(PP)
N$1951: 24.6 JP52.2 TP269.TP(PP)
N$1952: LED65.K(C)
N$1953: LED61.A LED62.A LED63.A LED64.A LED66.A
N$1954: Q111.1(B) R582.2
N$1955: IC91.3(Q0) IC93.1(I1) IC93.2(I2) Q117.1(G) Q118.1(G)
N$1956: IC91.14(Q1) IC93.6(I6)
N$1957: 23.3 IC93.11(O6) TP256.TP(PP)
N$1958: Q112.1(B) Q112.2(C) Q113.1(B) R580.1 R601.1 X33.2
N$1959: Q113.3(E) R584.2
N$1960: Q112.3(E) R583.2
N$1961: IC94.7(B:+IN) R571.1 R585.1
N$1962: IC99.2(A:-IN) R569.2
N$1963: Q115.1(B) R586.2 R606.1
N$1964: Q116.3(D) R587.2
N$1965: IC92.2(VO) R563.2
N$1966: IC92.3(VI) Q114.2(C)
N$1967: IC96.5(CV)
N$1968: IC96.3(Q) IC97.4(A:A) IC97.12(B:A)
N$1969: D152.1(+) R590.1
N$1970: 23.10 D144.2(-) D145.2(-) JP55.1 TP263.TP(PP)
N$1971: JP55.2 R591.2 R592.2
N$1972: IC97.9(B:!Q) IC97.11(B:B) R595.2
N$1973: C141.1 IC97.14(B:T2) R593.1
N$1974: JP51.1 R594.2
N$1975: IC93.15(O2) R582.1
N$1976: 24.12 R595.1 TP276.TP(PP)
N$1977: D149.1(+) JP53.2
N$1978: IC99.1(A:OUT) R596.2
N$1979: C142.1 R596.1 R597.1
N$1980: IC99.5(B:+IN) Q118.3(D) R597.2 R598.2
N$1981: IC99.6(B:-IN) R599.1 R600.2
N$1982: D150.1(+) JP54.1
N$1983: JP52.3 R587.1
N$1984: IC94.13(D:OUT) JP52.1 Q116.1(G) R588.2
N$1985: R581.1 X31.21
N$1986: IC93.16(O1) Q117.3(D) R608.1
N$1987: D154.2(-) R611.1 R612.1
N$1988: 23.8 R608.2 TP261.TP(PP)
N$1989: Q117.2(S) R607.2
N$1990: D155.1(+) X31.1
N$1991: Q115.3(E) R605.1
N$1992: C139.2 D152.2(-) D156.C IC96.2(TR) IC96.6(THR) R589.1
N$1993: Q119.1(B) R609.1
N$1994: Q120.3(D) R609.2
N$1995: Q119.2(C) R564.2 SJMP11.2
N$1996: IC99.7(B:OUT) R581.2 R586.1 R598.1
N$1997: IC94.2(A:OUT) R576.1
N$1998: IC97.7(A:!Q) Q120.1(G)
N$1999: C143.2 IC97.2(A:T2) R610.1
V+: D154.1(+) Q111.3(E) Q114.3(E) Q119.3(E) SJMP11.1 X31.6 ; also sheet 2,3,4,5,6,7,9,10,11,12,13
VCC: 6V11.TP(PP) C135.1 IC94.3(P:V+) IC95.1(OUT) IC99.8(P:V+) R571.2 R574.2 R577.1 R599.2 ; also sheet 2,3,4,5,6,7,9,10,11,12,13
Unconnected: IC91.4(Q7) IC91.5(Q9) IC91.7(Q6) IC91.9(Q8) IC96.7(DIS) IC97.6(A:Q) IC97.10(B:Q) X31.20 X31.24

### Notes on the sheet
- Externe Beschaltung
- Variante "eine LED leuchtet"
- Variante "alle LEDs bis und
   mit Gang X leuchten"
- Anzeige:
- Klemmleisten
  Ausgang:
- Gang 1
- DauerPlus
  Konstant-Strom für LEDs
  Gang 1
  Gang 2
  Gang 3
  Gang 4
  Gang 5
  Neutrallampe
  Blinker rechts
  Blinker zusammen
  Blinker links
  Masse
- Gang 1
- Gang 2
- Gang 2
- Gang 3
- Gang 3
- Gang 1 | Gang 2 | Gang 3 | Gang 4 | Gang 5
- Gang 4
- Gang 4 | Klemmleisten Ausgang:
- Gang 5
- Gang 5
- Zündugsplus
  Choke
  Öldrucklampe
  Temperaturlampe
  Ladekontrolllampe
  Tankgeber (100hm)
  ABS-Lampe
  Lampentest
  Warnlampe
  Fernlichtlampe
  Geschwindigkeitssignal
  Menütaster
- Stromquelle für Gang
  LEDs. Für mehr als 12mA
  muss ein Widerstand "R_user"
  eingelötet werden. Für weniger
  muss der 1kOhm SMD Widerstand
  neben R_user entfernt werden
  I = 12V/1kOhm(default)+12V/R_user
  I= 12mA (default) + 12V/R_user
  Beispiel:
  R_user      Strom in LEDs
  1 kOhm     22-26mA
  ohne       11-13mA
- Externe Beschaltung
- an Zündungsplus anhängen
  (Neutral leuchtet wenn Gang 0
  eingelegt und Zündschlüssel steckt )
- Neutrallampe
  für eigene
  Ganganzeige
- DauerPlus Batterie 12V (rot weiss)
  Ganganzeige Signal C (gelb weiss)
  Ganganzeige Signal B (gelb schwarz)
  Ganganzeige Signal A (gelb dunkelblau)
  12V/350mA zum Starknopf (schwarz grün)
  Zündungsplus 12V (grün schwarz)
  Reservelampe (weiss)
  ABS Leuchte (blau)
  Ladekontrollleuchte (schaltet auf Masse) (violett schwarz)
  Temperaturleuchte (schaltet auf Masse) (braun schwarz)
  Öldruckleuchte (schaltet auf Masse) (braun grün)
  Chokelampe (schaltet auf Masse) (violett weiss)
- BL resistors
- 1k
- an Ausgang "Neutrallampe" anhängen
- Masse (braun)
  Lampentest (schaltet auf Masse)(weiss blau)
  Fernlichtlampe (12V) (weiss)
  Drehzahl Zündspule (schwarz blau)
  Blinker rechts (blau scharz)
  Masse (braun)
  Blinker links (blau rot)
  nicht angeschlossen
  Tachosiganl zum Blinrelais (balu grün)
  Tachogeber (gelb)
  Masse Tachobeger (braun)
  Tachobeleuchtung (12V Zündungsplus) (grau blau)
- RES | BAR
- 4.7V | rising edge trigger A
- non retriggerable
- ZündungsPlus
- current source 96mA
- 6V regulated for Opamps
- nicht bestückt
- retriggerable
- Standard panel Fiducial | panel Fiducial with solder mask around fiducial

## Library data of the parts
1-24 = con WAGO BMW:2081-1132: WAGO SREW CLAMP
6V 6V1-6V11 10V 10V1-10V11 START START1-START11 TP1-TP276 = testpin_BMW:TPS: TEST PIN
C1-C3 C13 C14 C16 C26-C28 C38-C40 C50-C52 C62-C64 C74-C76 C86-C88 C98-C100 C107 C108 C120-C122 C132-C134 C144 = Seeed-Capacitor-2016:CERAMIC-100UF-6.3V-20%-X5R(1206): 302010183; MPN: GRM31CR60J107ME39L; VALUE: 100uf
C4 C6-C11 C17 C19-C24 C29 C31-C36 C41 C43-C48 C53 C55-C60 C65 C67-C72 C77 C79-C84 C89 C91-C96 C102-C106 C109-C111 C113-C118 C123 C125-C130 C135 C137-C142 = Seeed-Capacitor-2016:CERAMIC-100NF-50V-10%-X7R(0805): 302010165; MPN: CC0805KRX7R9BB104; VALUE: 100nf
C5 C12 C15 C18 C25 C30 C37 C42 C49 C54 C61 C66 C73 C78 C85 C90 C97 C101 C112 C119 C124 C131 C136 C143 = Seeed-Capacitor-2016:CERAMIC-4.7UF-25V-10%-X5R(0805): 302010146; MPN: CC0805KKX5R8BB475; VALUE: 4.7uf
D1 D2 D7-D10 D15 D16 D21-D24 D29 D30 D35-D38 D43 D44 D49-D52 D56-D58 D63-D66 D70-D72 D74 D75 D79 D80 D85-D88 D92 D93 D98-D100 D104 D107-D110 D115 D116 D121-D124 D128 D129 D134-D137 D141 D142 D147-D150 D154 D155 = Diode-do214ac:DIODE-GEN-PURPOSE-1KV-1A(DO-214AC): 304010013
D3 D5 D6 D11 D14 D18-D20 D25 D28 D32-D34 D39 D42 D46-D48 D53 D60-D62 D67 D76 D82-D84 D89 D95-D97 D102 D103 D105 D106 D111 D118-D120 D125 D131-D133 D138 D144-D146 D151 = Diode-do214ac:DIODE-GEN-PURPOSE-1KV-1A(DO-214AC): 304010013; MPN: 1N4007; VALUE: 1N4007
D4 D17 D31 D45 D59 D73 D81 D94 D117 D130 D143 D156 = diode:CGRM400*-G: Molded plasitc,JEDEC SOD-123/Mini SMA Source: Comchip CGRM4001-G.pdf
D12 D26 D40 D54 D68 D77 D90 D112 D113 D126 D139 D152 = Diode-do214ac:DIODE-GEN-PURPOSE-1KV-1A(DO-214AC): 304010013; MPN: 1N4007
D13 D27 D41 D55 D69 D78 D91 D101 D114 D127 D140 D153 = Suppressor_Diode_DO214AA:SM6T: Z DIODE
FID1 FID1B FID1B1 FID2 FID2B FID2B1 FID3-FID48 FID101-FID104 = Fiducial:FIDUCIAL: For use by pick and place machines to calibrate the vision/machine, 1mm By microbuilder.eu
IC1 IC10 IC19 IC28 IC37 IC46 IC55 IC64 IC73 IC82 IC91 IC105 = 4028:4028: BCD to decimal DECODER
IC2 IC11 IC20 IC29 IC38 IC47 IC56 IC65 IC74 IC83 IC92 IC109 = linear_BMW:*317: Positive VOLTAGE REGULATOR
IC3 IC12 IC21 IC30 IC39 IC48 IC57 IC66 IC75 IC84 IC93 IC107 = uln-udn:ULN2004A: DRIVER ARRAY
IC4 IC13 IC22 IC31 IC40 IC49 IC58 IC67 IC76 IC85 IC94 IC108 = LM339:LM339: Low Power Low Offset Voltage Quad Comparators with open collector; LM139/LM239/LM339/LM2901/LM3302
IC5 IC8 IC14 IC17 IC23 IC26 IC32 IC35 IC41 IC44 IC50 IC53 IC59 IC62 IC68 IC71 IC77 IC80 IC86 IC89 IC95 IC98 IC102 IC104 = 78LXX:78LXX
IC6 IC15 IC24 IC33 IC42 IC51 IC60 IC69 IC78 IC87 IC96 IC110 = linear:*555: TIMER
IC7 IC16 IC25 IC34 IC43 IC52 IC61 IC70 IC79 IC88 IC97 IC111 = 45xx:4538: Dual precision monostable MULTIVIBRATOR
IC9 IC18 IC27 IC36 IC45 IC54 IC63 IC72 IC81 IC90 IC99 IC101 = linear_BMW:LM358: OP AMP also LM158; LM258; LM2904 Source: http://cache.national.com/ds/LM/LM158.pdf
JP1 JP3-JP6 JP8-JP11 JP13-JP16 JP18-JP21 JP23-JP26 JP28-JP31 JP33-JP36 JP38-JP41 JP43-JP46 JP48-JP51 JP53-JP55 JP101-JP104 = Switch Aliexpress 2:JP2E: JUMPER
JP2 JP7 JP12 JP17 JP22 JP27 JP32 JP37 JP42 JP47 JP52 JP105 = Switch Aliexpress 2:JP2E_ORIG
LED1-LED66 LED101-LED106 = led:LED: LED OSRAM: - CHIPLED LG R971, LG N971, LY N971, LG Q971, LY Q971, LO R971, LY R971 LH N974, LH R974 LS Q976, LO Q976, LY Q976 LO Q996 - Hyper CHIPLED LW Q18S LB Q993, LB Q99A, LB R99A - SideLED LS A670, LO A670, LY A670, LG A670, LP A670 LB A673, LV A673, LT A673, LW A673 LH A674 LY A675 LS A676, LA A676, LO A676, LY A676, LW A676 LS A679, LY A679, LG A679 - Hyper Micro SIDELED® LS Y876, LA Y876, LO Y876, LY Y876 LT Y87S - SmartLED LW L88C, LW L88S LB L89C, LB L89S, LG L890 LS L89K, LO L89K, LY L89K LS L896, LA L896, LO L896, LY L896 - TOPLED LS T670, LO T670, LY T670, LG T670, LP T670 LSG T670, LSP T670, LSY T670, LOP T670, LYG T670 LG T671, LOG T671, LSG T671 LB T673, LV T673, LT T673, LW T673 LH T674 LS T676, LA T676, LO T676, LY T676, LB T676, LH T676, LSB T676, LW T676 LB T67C, LV T67C, LT T67C, LS T67K, LO T67K, LY T67K, LW E67C LS E67B, LA E67B, LO E67B, LY E67B, LB E67C, LV E67C, LT E67C LW T67C LS T679, LY T679, LG T679 LS T770, LO T770, LY T770, LG T770, LP T770 LB T773, LV T773, LT T773, LW T773 LH T774 LS E675, LA E675, LY E675, LS T675 LS T776, LA T776, LO T776, LY T776, LB T776 LHGB T686 LT T68C, LB T68C - Hyper Mini TOPLED® LB M676 - Mini TOPLED Santana® LG M470 LS M47K, LO M47K, LY M47K Source: http://www.osram.convergy.de LUXEON: - LUMILED® LXK2-PW12-R00, LXK2-PW12-S00, LXK2-PW14-U00, LXK2-PW14-V00 LXK2-PM12-R00, LXK2-PM12-S00, LXK2-PM14-U00 LXK2-PE12-Q00, LXK2-PE12-R00, LXK2-PE12-S00, LXK2-PE14-T00, LXK2-PE14-U00 LXK2-PB12-K00, LXK2-PB12-L00, LXK2-PB12-M00, LXK2-PB14-N00, LXK2-PB14-P00, LXK2-PB14-Q00 LXK2-PR12-L00, LXK2-PR12-M00, LXK2-PR14-Q00, LXK2-PR14-R00 LXK2-PD12-Q00, LXK2-PD12-R00, LXK2-PD12-S00 LXK2-PH12-R00, LXK2-PH12-S00 LXK2-PL12-P00, LXK2-PL12-Q00, LXK2-PL12-R00 Source: www.luxeon.com KINGBRIGHT: KA-3528ASYC Source: www.kingbright.com
Q1 Q3 Q9-Q11 Q13 Q19-Q21 Q23 Q29-Q31 Q33 Q39-Q41 Q43 Q49-Q51 Q53 Q59-Q61 Q63 Q69-Q71 Q73 Q79-Q81 Q83 Q89-Q91 Q93 Q99 Q100 Q106-Q108 Q110 Q116-Q118 Q120 = Seeed-Transistor-2016:SMD-MOSFET-N-CH-50V-200MA-BSS138W-7-F(SOT-23): 305030000; MPN: BSS138W-7-F; VALUE: BSS138W-7-F
Q2 Q4-Q7 Q12 Q14-Q17 Q22 Q24-Q27 Q32 Q34-Q37 Q42 Q44-Q47 Q52 Q54-Q57 Q62 Q64-Q67 Q72 Q74-Q77 Q82 Q84-Q87 Q92 Q94-Q97 Q101 Q102 Q104 Q105 Q109 Q111-Q114 Q119 = Transistor_SOT89:PNP-TRANSISTOR_: PNP TRANSISTOR
Q8 Q18 Q28 Q38 Q48 Q58 Q68 Q78 Q88 Q98 Q103 Q115 = Transistor_SOT89:NPN-TRANSISTOR_: NPN TRANSISTOR
R1-R3 R15-R17 R19-R25 R27 R41-R44 R50 R56-R58 R70-R72 R74-R80 R82 R86 R88 R96-R99 R104 R107-R111 R120 R121 R124 R125 R130-R132 R135 R140-R144 R149 R155-R157 R169-R171 R173-R179 R181 R185 R187 R195-R198 R204 R210-R212 R224-R226 R228-R234 R236 R250 R251 R253 R259 R265-R267 R279-R281 R283-R289 R291 R305 R306 R308 R314 R320-R322 R333-R335 R341 R347-R349 R361-R363 R365-R371 R373 R384-R386 R392 R398-R400 R412-R414 R416-R422 R424 R435-R437 R443 R449-R451 R463-R465 R467-R473 R475 R486-R488 R494 R500-R502 R514-R516 R518-R524 R526 R537-R539 R545 R551-R553 R565-R567 R569-R575 R577 R588-R590 R596 R602-R604 = Seeed-Resistor-2016:SMD-RES-10K-1%-1/8W(0805): 301010361; MPN: RC0805FR-0710KL; VALUE: 10K
R4 R32 R61 R87 R115 R160 R186 R215 R241 R252 R270 R296 R325 R352 R377 R403 R428 R454 R479 R505 R530 R556 R581 R607 = Seeed-Resistor-2016:SMD-RES-220R-5%-1/8W(0805): 301010315; MPN: RC0805JR-07220RL; VALUE: 220R
R5 R9 R11 R33 R36 R37 R59 R62 R68 R91 R92 R102 R106 R134 R158 R161 R167 R190 R191 R213 R216 R222 R245 R246 R268 R271 R277 R297 R298 R300 R301 R323 R326 R350 R353 R359 R379 R380 R401 R404 R410 R430 R431 R452 R455 R461 R481 R482 R503 R506 R512 R532 R533 R554 R557 R563 R583 R584 R605 R608 = Seeed-Resistor-2016:SMD-RES-13R-5%-1/4W(1206): 301010405; MPN: RC1206JR-0713RL; VALUE: 13R
R6 R30 R35 R51 R53 R54 R60 R85 R90 R101 R112-R114 R128 R150 R152 R153 R159 R184 R189 R205 R207 R208 R214 R239 R243 R244 R260 R262 R263 R269 R294 R295 R299 R315 R317 R318 R324 R342 R344 R345 R351 R376 R378 R393 R395 R396 R402 R427 R429 R444 R446 R447 R453 R478 R480 R495 R497 R498 R504 R529 R531 R546 R548 R549 R555 R580 R582 R597 R599 R600 R606 = Seeed-Resistor-2016:SMD-RES-1K-5%-1/8W(0805): 301010311; MPN: RC0805JR-071KL; VALUE: 1K
R7 R14 R31 R34 R45 R46 R55 R67 R69 R100 R103 R118 R127 R129 R136 R137 R154 R166 R168 R199 R200 R209 R221 R223 R254 R255 R264 R276 R278 R309 R310 R319 R336 R337 R346 R358 R360 R387 R388 R397 R409 R411 R438 R439 R448 R460 R462 R489 R490 R499 R511 R513 R540 R541 R550 R562 R564 R591 R592 R601 = rcl:R-EU_: RESISTOR, European symbol
R8 R10 R18 R28 R29 R38 R39 R47 R49 R52 R63 R64 R73 R83 R84 R89 R93 R94 R105 R116 R117 R122 R123 R126 R139 R145 R146 R148 R151 R162 R163 R172 R182 R183 R192 R193 R201 R203 R206 R217 R218 R227 R237 R238 R240 R242 R247 R248 R256 R258 R261 R272 R273 R282 R292 R293 R302 R303 R307 R311 R313 R316 R327 R328 R331 R338 R340 R343 R354 R355 R364 R374 R375 R381 R382 R389 R391 R394 R405 R406 R415 R425 R426 R432 R433 R440 R442 R445 R456 R457 R466 R476 R477 R483 R484 R491 R493 R496 R507 R508 R517 R527 R528 R534 R535 R542 R544 R547 R558 R559 R568 R578 R579 R585 R586 R593 R595 R598 R609 R610 = Seeed-Resistor-2016:SMD-RES-4.7K-5%-1/8W(0805): 301010306; MPN: RC0805JR-074K7L; VALUE: 4.7K
R12 R13 R26 R40 R48 R65 R66 R81 R95 R119 R133 R138 R147 R164 R165 R180 R188 R194 R202 R219 R220 R235 R249 R257 R274 R275 R290 R304 R312 R329 R330 R332 R339 R356 R357 R372 R383 R390 R407 R408 R423 R434 R441 R458 R459 R474 R485 R492 R509 R510 R525 R536 R543 R560 R561 R576 R587 R594 R611 R612 = Seeed-Resistor-2016:SMD-RES-2.2K-5%-1/8W(0805): 301010333; MPN: RC0805JR-072K2L; VALUE: 2.2K
SJMP SJMP1-SJMP11 = jumper:SJ: SMD solder JUMPER
U$13 U$18 U$21 U$22 U$25 U$30 U$33 U$34 = stencil_hole:STC
X1 X4 X7 X10 X13 X16 X19 X22 X25 X28 X31 X101 = con_BMW:CON_BMW: BMW CONNECTOR
X2 X5 X8 X11 X14 X17 X20 X23 X26 X29 X32 X103 = con_Molex_BMW:22-23-2051: .100" (2.54mm) Center Header - 5 Pin; MF: MOLEX; MPN: 22-23-2051; OC_FARNELL: 1462952; OC_NEWARK: 38C9178
X3 X6 X9 X12 X15 X18 X21 X24 X27 X30 X33 X102 = con_Molex_BMW:22-23-2021: .100" (2.54mm) Center Header - 2 Pin; MF: MOLEX; MPN: 22-23-2021; OC_FARNELL: 1462926; OC_NEWARK: 25C3832